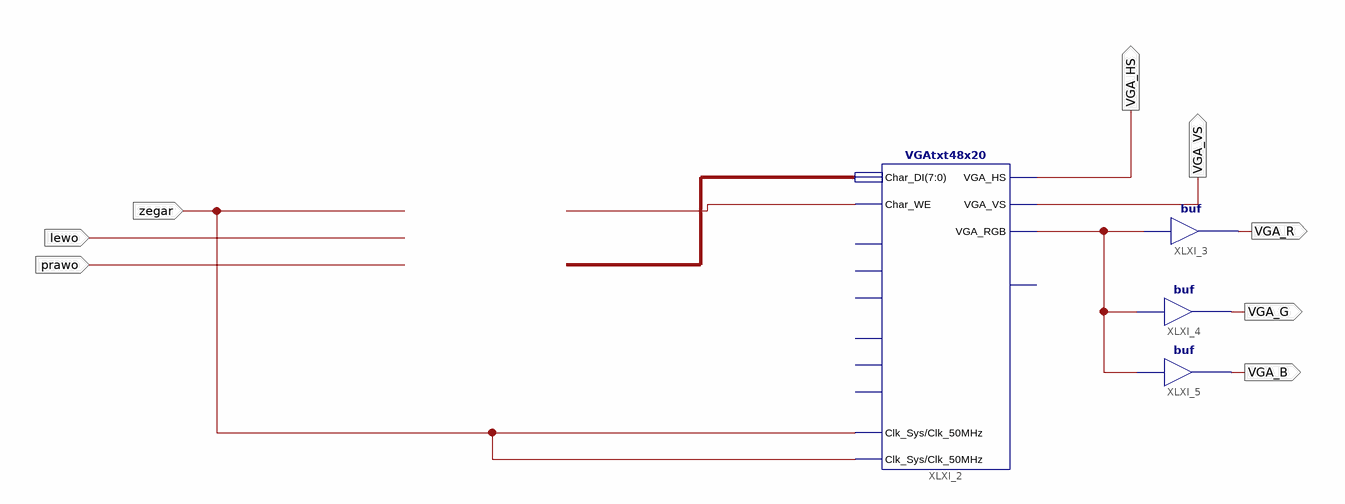
[diagram p0: schematic sheet 1]
// Xilinx ISE schematic schemat_better.sch (spartan3e) as structural Verilog: 4 symbols, 8 ports
module schemat_better (
  input  zegar,
  input  lewo,
  input  prawo,
  output VGA_VS,
  output VGA_HS,
  output VGA_R,
  output VGA_G,
  output VGA_B
);

  wire XLXN_4, XLXN_6;
  wire [7:0] XLXN_5;

  VGAtxt48x20 XLXI_2 (
    .Char_DI(XLXN_5), .Clk_Sys(zegar), .Clk_50MHz(zegar), .VGA_HS(VGA_HS), .VGA_VS(VGA_VS), .VGA_RGB(XLXN_6),
    .Char_WE(XLXN_4));  // open: Home, NewLine, Goto00, CursorOn, ScrollEn, ScrollClear, Busy
  buf XLXI_3 (VGA_R, XLXN_6);
  buf XLXI_4 (VGA_G, XLXN_6);
  buf XLXI_5 (VGA_B, XLXN_6);
endmodule
